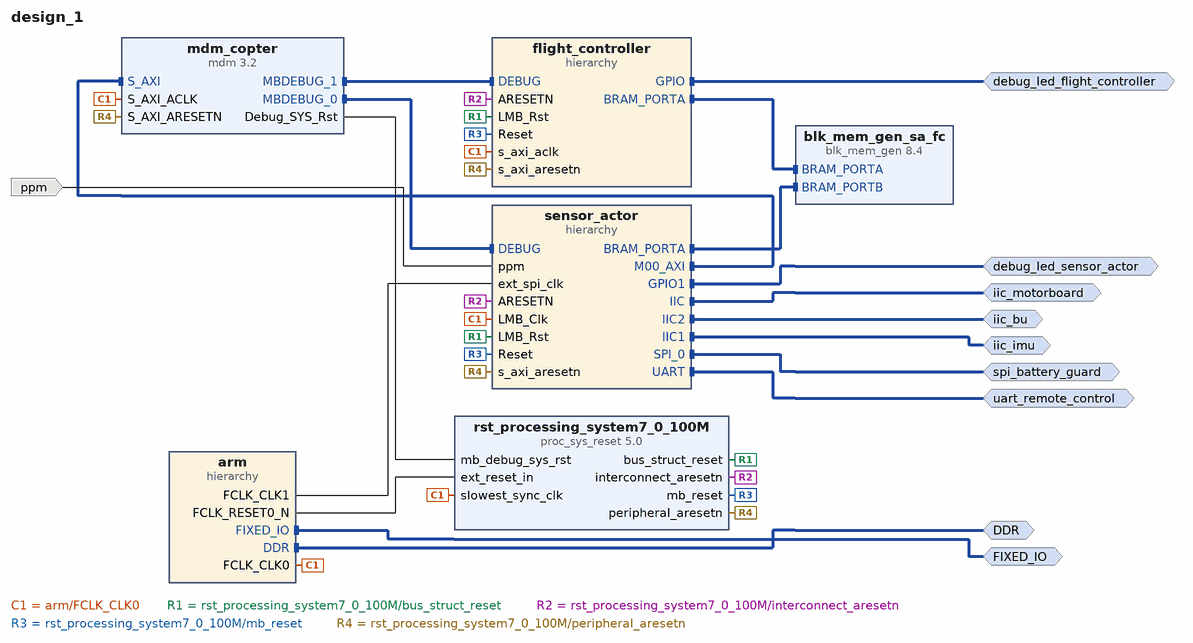
[diagram p0: block diagram of the top level]
# Vivado block design design_1, xc7z020clg484-1, Vivado 2018.3
create_bd_design design_1

create_bd_intf_port -mode Master -vlnv xilinx.com:interface:ddrx_rtl:1.0 DDR
create_bd_intf_port -mode Master -vlnv xilinx.com:display_processing_system7:fixedio_rtl:1.0 FIXED_IO
create_bd_intf_port -mode Master -vlnv xilinx.com:interface:gpio_rtl:1.0 debug_led_flight_controller
create_bd_intf_port -mode Master -vlnv xilinx.com:interface:gpio_rtl:1.0 debug_led_sensor_actor
create_bd_intf_port -mode Master -vlnv xilinx.com:interface:iic_rtl:1.0 iic_bu
create_bd_intf_port -mode Master -vlnv xilinx.com:interface:iic_rtl:1.0 iic_motorboard
create_bd_intf_port -mode Master -vlnv xilinx.com:interface:iic_rtl:1.0 iic_imu
create_bd_intf_port -mode Master -vlnv xilinx.com:interface:spi_rtl:1.0 spi_battery_guard
create_bd_intf_port -mode Master -vlnv xilinx.com:interface:uart_rtl:1.0 uart_remote_control
create_bd_port -dir I ppm

create_bd_cell -type hier flight_controller
create_bd_cell -type hier sensor_actor
create_bd_cell -type hier arm
create_bd_cell -type ip -vlnv xilinx.com:ip:blk_mem_gen:8.4 blk_mem_gen_sa_fc
set_property -dict [list \
  CONFIG.EN_SAFETY_CKT false \
  CONFIG.Enable_B Use_ENB_Pin \
  CONFIG.Memory_Type True_Dual_Port_RAM \
  CONFIG.Port_B_Clock 100 \
  CONFIG.Port_B_Enable_Rate 100 \
  CONFIG.Port_B_Write_Rate 50 \
  CONFIG.Use_RSTB_Pin true \
] [get_bd_cells blk_mem_gen_sa_fc]
create_bd_cell -type ip -vlnv xilinx.com:ip:mdm:3.2 mdm_copter
set_property -dict {CONFIG.C_MB_DBG_PORTS 2 CONFIG.C_USE_UART 1} [get_bd_cells mdm_copter]
create_bd_cell -type ip -vlnv xilinx.com:ip:proc_sys_reset:5.0 rst_processing_system7_0_100M

# ---- hierarchy /flight_controller ----
current_bd_instance /flight_controller
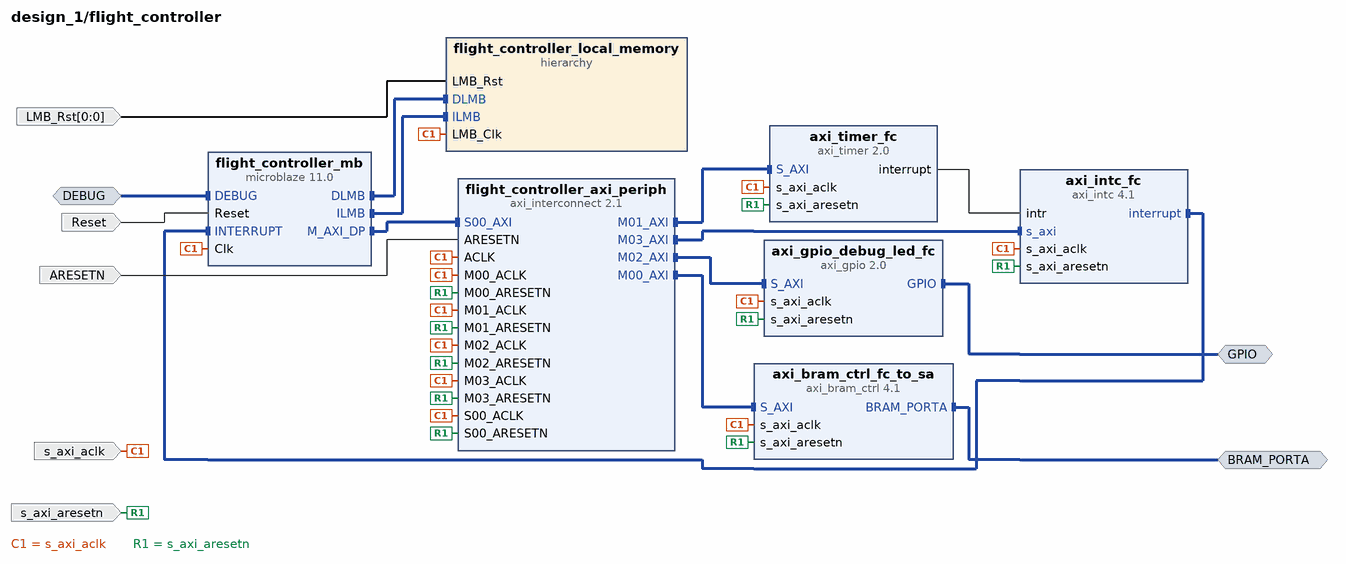
[diagram p1: block diagram inside /flight_controller]
create_bd_intf_pin -mode Master -vlnv xilinx.com:interface:gpio_rtl:1.0 GPIO
create_bd_intf_pin -mode Slave -vlnv xilinx.com:interface:mbdebug_rtl:3.0 DEBUG
create_bd_intf_pin -mode Master -vlnv xilinx.com:interface:bram_rtl:1.0 BRAM_PORTA
create_bd_pin -dir I -type clk s_axi_aclk
create_bd_pin -dir I -type rst s_axi_aresetn
create_bd_pin -dir I -type rst Reset
create_bd_pin -dir I -type rst ARESETN
create_bd_pin -dir I -from 0 -to 0 -type rst LMB_Rst

create_bd_cell -type hier flight_controller_local_memory
create_bd_cell -type ip -vlnv xilinx.com:ip:axi_bram_ctrl:4.1 axi_bram_ctrl_fc_to_sa
set_property -dict {CONFIG.C_SELECT_XPM 0 CONFIG.SINGLE_PORT_BRAM 1} [get_bd_cells axi_bram_ctrl_fc_to_sa]
create_bd_cell -type ip -vlnv xilinx.com:ip:axi_gpio:2.0 axi_gpio_debug_led_fc
set_property -dict {CONFIG.C_ALL_OUTPUTS 1 CONFIG.C_GPIO_WIDTH 2} [get_bd_cells axi_gpio_debug_led_fc]
create_bd_cell -type ip -vlnv xilinx.com:ip:axi_intc:4.1 axi_intc_fc
create_bd_cell -type ip -vlnv xilinx.com:ip:axi_timer:2.0 axi_timer_fc
create_bd_cell -type ip -vlnv xilinx.com:ip:microblaze:11.0 flight_controller_mb
set_property -dict [list \
  CONFIG.C_D_AXI 1 \
  CONFIG.C_USE_DIV 1 \
  CONFIG.C_USE_FPU 2 \
  CONFIG.C_USE_HW_MUL 2 \
] [get_bd_cells flight_controller_mb]
create_bd_cell -type ip -vlnv xilinx.com:ip:axi_interconnect:2.1 flight_controller_axi_periph
set_property -dict {CONFIG.NUM_MI 4 CONFIG.SYNCHRONIZATION_STAGES 2} [get_bd_cells flight_controller_axi_periph]

# ---- hierarchy /flight_controller/flight_controller_local_memory ----
current_bd_instance /flight_controller/flight_controller_local_memory
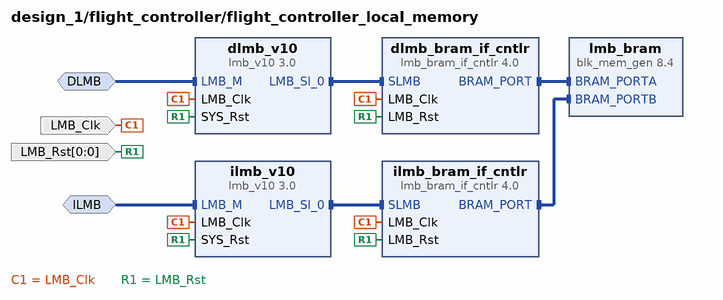
[diagram p2: block diagram inside /flight_controller/flight_controller_local_memory]
create_bd_intf_pin -mode MirroredMaster -vlnv xilinx.com:interface:lmb_rtl:1.0 DLMB
create_bd_intf_pin -mode MirroredMaster -vlnv xilinx.com:interface:lmb_rtl:1.0 ILMB
create_bd_pin -dir I -type clk LMB_Clk
create_bd_pin -dir I -from 0 -to 0 -type rst LMB_Rst

create_bd_cell -type ip -vlnv xilinx.com:ip:lmb_v10:3.0 dlmb_v10
create_bd_cell -type ip -vlnv xilinx.com:ip:lmb_v10:3.0 ilmb_v10
create_bd_cell -type ip -vlnv xilinx.com:ip:lmb_bram_if_cntlr:4.0 dlmb_bram_if_cntlr
create_bd_cell -type ip -vlnv xilinx.com:ip:lmb_bram_if_cntlr:4.0 ilmb_bram_if_cntlr
create_bd_cell -type ip -vlnv xilinx.com:ip:blk_mem_gen:8.4 lmb_bram
set_property -dict [list \
  CONFIG.EN_SAFETY_CKT false \
  CONFIG.Enable_B Use_ENB_Pin \
  CONFIG.Memory_Type True_Dual_Port_RAM \
  CONFIG.Port_B_Clock 100 \
  CONFIG.Port_B_Enable_Rate 100 \
  CONFIG.Port_B_Write_Rate 50 \
  CONFIG.Use_RSTB_Pin true \
] [get_bd_cells lmb_bram]

# ---- hierarchy /sensor_actor ----
current_bd_instance /sensor_actor
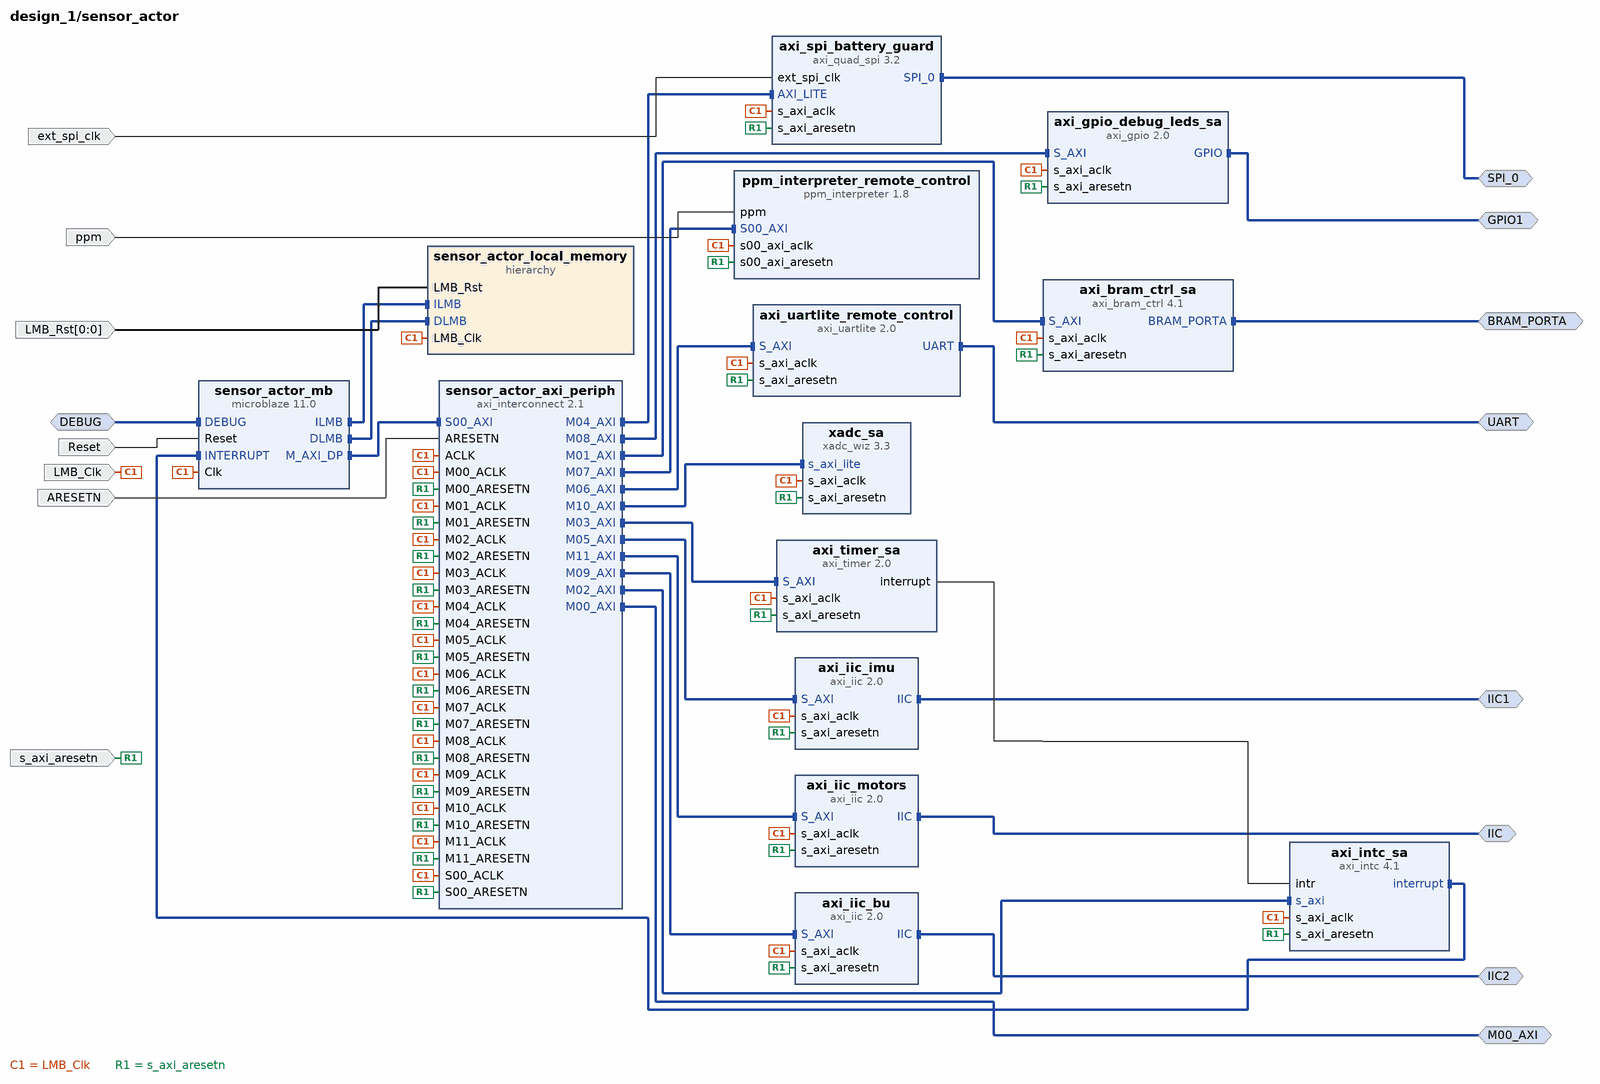
[diagram p3: block diagram inside /sensor_actor]
create_bd_intf_pin -mode Master -vlnv xilinx.com:interface:iic_rtl:1.0 IIC
create_bd_intf_pin -mode Master -vlnv xilinx.com:interface:iic_rtl:1.0 IIC1
create_bd_intf_pin -mode Master -vlnv xilinx.com:interface:spi_rtl:1.0 SPI_0
create_bd_intf_pin -mode Master -vlnv xilinx.com:interface:uart_rtl:1.0 UART
create_bd_intf_pin -mode Master -vlnv xilinx.com:interface:gpio_rtl:1.0 GPIO1
create_bd_intf_pin -mode Slave -vlnv xilinx.com:interface:mbdebug_rtl:3.0 DEBUG
create_bd_intf_pin -mode Master -vlnv xilinx.com:interface:iic_rtl:1.0 IIC2
create_bd_intf_pin -mode Master -vlnv xilinx.com:interface:aximm_rtl:1.0 M00_AXI
create_bd_intf_pin -mode Master -vlnv xilinx.com:interface:bram_rtl:1.0 BRAM_PORTA
create_bd_pin -dir I ppm
create_bd_pin -dir I -type clk LMB_Clk
create_bd_pin -dir I -type rst s_axi_aresetn
create_bd_pin -dir I -type clk ext_spi_clk
create_bd_pin -dir I -type rst Reset
create_bd_pin -dir I -from 0 -to 0 -type rst LMB_Rst
create_bd_pin -dir I -type rst ARESETN

create_bd_cell -type hier sensor_actor_local_memory
create_bd_cell -type ip -vlnv ppm:user:ppm_interpreter:1.8 ppm_interpreter_remote_control
create_bd_cell -type ip -vlnv xilinx.com:ip:axi_bram_ctrl:4.1 axi_bram_ctrl_sa
set_property -dict {CONFIG.C_SELECT_XPM 0 CONFIG.SINGLE_PORT_BRAM 1} [get_bd_cells axi_bram_ctrl_sa]
create_bd_cell -type ip -vlnv xilinx.com:ip:axi_gpio:2.0 axi_gpio_debug_leds_sa
set_property -dict {CONFIG.C_ALL_OUTPUTS 1 CONFIG.C_GPIO_WIDTH 2} [get_bd_cells axi_gpio_debug_leds_sa]
create_bd_cell -type ip -vlnv xilinx.com:ip:axi_iic:2.0 axi_iic_bu
set_property -dict {CONFIG.IIC_FREQ_KHZ 100} [get_bd_cells axi_iic_bu]
create_bd_cell -type ip -vlnv xilinx.com:ip:axi_iic:2.0 axi_iic_motors
set_property -dict {CONFIG.IIC_FREQ_KHZ 100} [get_bd_cells axi_iic_motors]
create_bd_cell -type ip -vlnv xilinx.com:ip:axi_iic:2.0 axi_iic_imu
set_property -dict {CONFIG.IIC_FREQ_KHZ 100} [get_bd_cells axi_iic_imu]
create_bd_cell -type ip -vlnv xilinx.com:ip:axi_intc:4.1 axi_intc_sa
create_bd_cell -type ip -vlnv xilinx.com:ip:axi_quad_spi:3.2 axi_spi_battery_guard
set_property -dict [list \
  CONFIG.C_FIFO_DEPTH 0 \
  CONFIG.C_NUM_SS_BITS 2 \
  CONFIG.C_S_AXI4_ID_WIDTH 0 \
  CONFIG.C_USE_STARTUP 0 \
  CONFIG.FIFO_INCLUDED 0 \
  CONFIG.Multiples16 2 \
] [get_bd_cells axi_spi_battery_guard]
create_bd_cell -type ip -vlnv xilinx.com:ip:axi_timer:2.0 axi_timer_sa
create_bd_cell -type ip -vlnv xilinx.com:ip:axi_uartlite:2.0 axi_uartlite_remote_control
set_property -dict {CONFIG.C_BAUDRATE 19200} [get_bd_cells axi_uartlite_remote_control]
create_bd_cell -type ip -vlnv xilinx.com:ip:microblaze:11.0 sensor_actor_mb
set_property -dict {CONFIG.C_D_AXI 1 CONFIG.C_USE_DIV 1 CONFIG.C_USE_FPU 2 CONFIG.C_USE_HW_MUL 2} [get_bd_cells sensor_actor_mb]
create_bd_cell -type ip -vlnv xilinx.com:ip:axi_interconnect:2.1 sensor_actor_axi_periph
set_property -dict {CONFIG.NUM_MI 12 CONFIG.SYNCHRONIZATION_STAGES 2} [get_bd_cells sensor_actor_axi_periph]
create_bd_cell -type ip -vlnv xilinx.com:ip:xadc_wiz:3.3 xadc_sa
set_property -dict [list \
  CONFIG.ENABLE_RESET false \
  CONFIG.ENABLE_VCCDDRO_ALARM false \
  CONFIG.ENABLE_VCCPAUX_ALARM false \
  CONFIG.ENABLE_VCCPINT_ALARM false \
  CONFIG.INTERFACE_SELECTION Enable_AXI \
  CONFIG.OT_ALARM false \
  CONFIG.USER_TEMP_ALARM false \
  CONFIG.VCCAUX_ALARM false \
  CONFIG.VCCINT_ALARM false \
] [get_bd_cells xadc_sa]

# ---- hierarchy /sensor_actor/sensor_actor_local_memory ----
current_bd_instance /sensor_actor/sensor_actor_local_memory
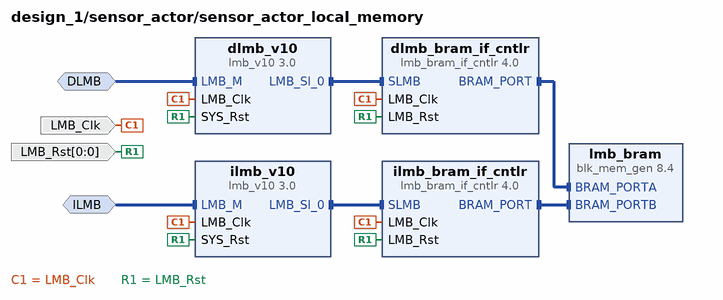
[diagram p4: block diagram inside /sensor_actor/sensor_actor_local_memory]
create_bd_intf_pin -mode MirroredMaster -vlnv xilinx.com:interface:lmb_rtl:1.0 DLMB
create_bd_intf_pin -mode MirroredMaster -vlnv xilinx.com:interface:lmb_rtl:1.0 ILMB
create_bd_pin -dir I -type clk LMB_Clk
create_bd_pin -dir I -from 0 -to 0 -type rst LMB_Rst

create_bd_cell -type ip -vlnv xilinx.com:ip:lmb_v10:3.0 dlmb_v10
create_bd_cell -type ip -vlnv xilinx.com:ip:lmb_v10:3.0 ilmb_v10
create_bd_cell -type ip -vlnv xilinx.com:ip:lmb_bram_if_cntlr:4.0 dlmb_bram_if_cntlr
create_bd_cell -type ip -vlnv xilinx.com:ip:lmb_bram_if_cntlr:4.0 ilmb_bram_if_cntlr
create_bd_cell -type ip -vlnv xilinx.com:ip:blk_mem_gen:8.4 lmb_bram
set_property -dict [list \
  CONFIG.EN_SAFETY_CKT false \
  CONFIG.Enable_B Use_ENB_Pin \
  CONFIG.Memory_Type True_Dual_Port_RAM \
  CONFIG.Port_B_Clock 100 \
  CONFIG.Port_B_Enable_Rate 100 \
  CONFIG.Port_B_Write_Rate 50 \
  CONFIG.Use_RSTB_Pin true \
] [get_bd_cells lmb_bram]

# ---- hierarchy /arm ----
current_bd_instance /arm
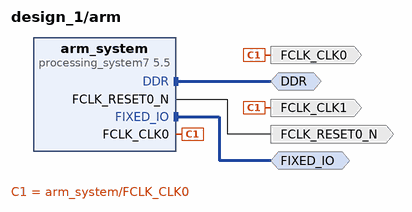
[diagram p5: block diagram inside /arm]
create_bd_intf_pin -mode Master -vlnv xilinx.com:interface:ddrx_rtl:1.0 DDR
create_bd_intf_pin -mode Master -vlnv xilinx.com:display_processing_system7:fixedio_rtl:1.0 FIXED_IO
create_bd_pin -dir O -type clk FCLK_CLK0
create_bd_pin -dir O -type clk FCLK_CLK1
create_bd_pin -dir O -type rst FCLK_RESET0_N

create_bd_cell -type ip -vlnv xilinx.com:ip:processing_system7:5.5 arm_system
set_property -dict [list \
  CONFIG.PCW_APU_PERIPHERAL_FREQMHZ 666.666667 \
  CONFIG.PCW_ENET0_ENET0_IO {MIO 16 .. 27} \
  CONFIG.PCW_ENET0_GRP_MDIO_ENABLE 1 \
  CONFIG.PCW_ENET0_GRP_MDIO_IO {MIO 52 .. 53} \
  CONFIG.PCW_ENET0_PERIPHERAL_ENABLE 1 \
  CONFIG.PCW_ENET0_RESET_ENABLE 0 \
  CONFIG.PCW_ENET_RESET_ENABLE 1 \
  CONFIG.PCW_ENET_RESET_SELECT {Share reset pin} \
  CONFIG.PCW_FPGA0_PERIPHERAL_FREQMHZ 100.000000 \
  CONFIG.PCW_FPGA1_PERIPHERAL_FREQMHZ 150.000000 \
  CONFIG.PCW_FPGA2_PERIPHERAL_FREQMHZ 50.000000 \
  CONFIG.PCW_GP0_EN_MODIFIABLE_TXN 0 \
  CONFIG.PCW_GP1_EN_MODIFIABLE_TXN 0 \
  CONFIG.PCW_GPIO_MIO_GPIO_ENABLE 1 \
  CONFIG.PCW_GPIO_MIO_GPIO_IO MIO \
  CONFIG.PCW_I2C_RESET_ENABLE 1 \
  CONFIG.PCW_PERIPHERAL_BOARD_PRESET part0 \
  CONFIG.PCW_PRESET_BANK1_VOLTAGE {LVCMOS 1.8V} \
  CONFIG.PCW_QSPI_GRP_SINGLE_SS_ENABLE 1 \
  CONFIG.PCW_QSPI_GRP_SINGLE_SS_IO {MIO 1 .. 6} \
  CONFIG.PCW_QSPI_PERIPHERAL_ENABLE 1 \
  CONFIG.PCW_QSPI_PERIPHERAL_FREQMHZ 200.000000 \
  CONFIG.PCW_QSPI_QSPI_IO {MIO 1 .. 6} \
  CONFIG.PCW_SD0_GRP_CD_ENABLE 1 \
  CONFIG.PCW_SD0_GRP_CD_IO {MIO 47} \
  CONFIG.PCW_SD0_GRP_WP_ENABLE 1 \
  CONFIG.PCW_SD0_GRP_WP_IO {MIO 46} \
  CONFIG.PCW_SD0_PERIPHERAL_ENABLE 1 \
  CONFIG.PCW_SD0_SD0_IO {MIO 40 .. 45} \
  CONFIG.PCW_SDIO_PERIPHERAL_FREQMHZ 50 \
  CONFIG.PCW_SINGLE_QSPI_DATA_MODE x4 \
  CONFIG.PCW_TTC0_PERIPHERAL_ENABLE 1 \
  CONFIG.PCW_TTC0_TTC0_IO EMIO \
  CONFIG.PCW_UART1_PERIPHERAL_ENABLE 1 \
  CONFIG.PCW_UART1_UART1_IO {MIO 48 .. 49} \
  CONFIG.PCW_UART_PERIPHERAL_FREQMHZ 50 \
  CONFIG.PCW_UIPARAM_DDR_FREQ_MHZ 533.333313 \
  CONFIG.PCW_UIPARAM_DDR_PARTNO {MT41J128M16 HA-15E} \
  CONFIG.PCW_USB0_PERIPHERAL_ENABLE 1 \
  CONFIG.PCW_USB0_RESET_ENABLE 0 \
  CONFIG.PCW_USB0_USB0_IO {MIO 28 .. 39} \
  CONFIG.PCW_USB_RESET_ENABLE 1 \
  CONFIG.PCW_USB_RESET_SELECT {Share reset pin} \
  CONFIG.PCW_USE_M_AXI_GP0 0 \
  CONFIG.preset ZedBoard \
] [get_bd_cells arm_system]
# 494 more settings of arm_system are not shown: defaults, MIO pin electricals, DDR timing, and values the tool derives

# ---- connections ----

current_bd_instance /flight_controller
connect_bd_intf_net [get_bd_intf_pins BRAM_PORTA] [get_bd_intf_pins axi_bram_ctrl_fc_to_sa/BRAM_PORTA]
connect_bd_intf_net [get_bd_intf_pins DEBUG] [get_bd_intf_pins flight_controller_mb/DEBUG]
connect_bd_intf_net [get_bd_intf_pins GPIO] [get_bd_intf_pins axi_gpio_debug_led_fc/GPIO]
connect_bd_intf_net [get_bd_intf_pins flight_controller_axi_periph/M03_AXI] [get_bd_intf_pins axi_intc_fc/s_axi]
connect_bd_intf_net [get_bd_intf_pins flight_controller_axi_periph/M00_AXI] [get_bd_intf_pins axi_bram_ctrl_fc_to_sa/S_AXI]
connect_bd_intf_net [get_bd_intf_pins flight_controller_mb/DLMB] [get_bd_intf_pins flight_controller_local_memory/DLMB]
connect_bd_intf_net [get_bd_intf_pins flight_controller_mb/ILMB] [get_bd_intf_pins flight_controller_local_memory/ILMB]
connect_bd_intf_net [get_bd_intf_pins axi_timer_fc/S_AXI] [get_bd_intf_pins flight_controller_axi_periph/M01_AXI]
connect_bd_intf_net [get_bd_intf_pins axi_gpio_debug_led_fc/S_AXI] [get_bd_intf_pins flight_controller_axi_periph/M02_AXI]
connect_bd_intf_net [get_bd_intf_pins axi_intc_fc/interrupt] [get_bd_intf_pins flight_controller_mb/INTERRUPT]
connect_bd_intf_net [get_bd_intf_pins flight_controller_mb/M_AXI_DP] [get_bd_intf_pins flight_controller_axi_periph/S00_AXI]
connect_bd_net -net axi_timer_asg_interrupt [get_bd_pins axi_timer_fc/interrupt] [get_bd_pins axi_intc_fc/intr]
connect_bd_net -net mb_dataminer_Clk [get_bd_pins s_axi_aclk] \
  [get_bd_pins flight_controller_local_memory/LMB_Clk] [get_bd_pins axi_bram_ctrl_fc_to_sa/s_axi_aclk] \
  [get_bd_pins axi_gpio_debug_led_fc/s_axi_aclk] [get_bd_pins axi_intc_fc/s_axi_aclk] [get_bd_pins axi_timer_fc/s_axi_aclk] \
  [get_bd_pins flight_controller_mb/Clk] [get_bd_pins flight_controller_axi_periph/ACLK] \
  [get_bd_pins flight_controller_axi_periph/S00_ACLK] [get_bd_pins flight_controller_axi_periph/M00_ACLK] \
  [get_bd_pins flight_controller_axi_periph/M01_ACLK] [get_bd_pins flight_controller_axi_periph/M02_ACLK] \
  [get_bd_pins flight_controller_axi_periph/M03_ACLK]
connect_bd_net -net rst_processing_system7_0_100M_peripheral_aresetn [get_bd_pins s_axi_aresetn] \
  [get_bd_pins axi_bram_ctrl_fc_to_sa/s_axi_aresetn] [get_bd_pins axi_gpio_debug_led_fc/s_axi_aresetn] \
  [get_bd_pins axi_intc_fc/s_axi_aresetn] [get_bd_pins axi_timer_fc/s_axi_aresetn] \
  [get_bd_pins flight_controller_axi_periph/S00_ARESETN] [get_bd_pins flight_controller_axi_periph/M00_ARESETN] \
  [get_bd_pins flight_controller_axi_periph/M01_ARESETN] [get_bd_pins flight_controller_axi_periph/M02_ARESETN] \
  [get_bd_pins flight_controller_axi_periph/M03_ARESETN]
connect_bd_net -net rst_processing_system7_0_100M_mb_reset [get_bd_pins Reset] [get_bd_pins flight_controller_mb/Reset]
connect_bd_net -net rst_processing_system7_0_100M_interconnect_aresetn [get_bd_pins ARESETN] [get_bd_pins flight_controller_axi_periph/ARESETN]
connect_bd_net [get_bd_pins LMB_Rst] [get_bd_pins flight_controller_local_memory/LMB_Rst]
set_property HDL_ATTRIBUTE.BMM_INFO_ADDRESS_SPACE {byte  0x40000000 32 > design_1 blk_mem_gen_sa_fc} [get_bd_cells axi_bram_ctrl_fc_to_sa]
set_property HDL_ATTRIBUTE.KEEP_HIERARCHY yes [get_bd_cells axi_bram_ctrl_fc_to_sa]
set_property HDL_ATTRIBUTE.BMM_INFO_PROCESSOR {microblaze-le > design_1 flight_controller/flight_controller_local_memory/dlmb_bram_if_cntlr design_1 flight_controller/axi_bram_ctrl_fc_to_sa} [get_bd_cells flight_controller_mb]
set_property HDL_ATTRIBUTE.KEEP_HIERARCHY yes [get_bd_cells flight_controller_mb]

current_bd_instance /flight_controller/flight_controller_local_memory
connect_bd_intf_net [get_bd_intf_pins dlmb_bram_if_cntlr/SLMB] [get_bd_intf_pins dlmb_v10/LMB_Sl_0]
connect_bd_intf_net [get_bd_intf_pins dlmb_bram_if_cntlr/BRAM_PORT] [get_bd_intf_pins lmb_bram/BRAM_PORTA]
connect_bd_intf_net [get_bd_intf_pins ilmb_bram_if_cntlr/SLMB] [get_bd_intf_pins ilmb_v10/LMB_Sl_0]
connect_bd_intf_net [get_bd_intf_pins DLMB] [get_bd_intf_pins dlmb_v10/LMB_M]
connect_bd_intf_net [get_bd_intf_pins ilmb_bram_if_cntlr/BRAM_PORT] [get_bd_intf_pins lmb_bram/BRAM_PORTB]
connect_bd_intf_net [get_bd_intf_pins ILMB] [get_bd_intf_pins ilmb_v10/LMB_M]
connect_bd_net -net microblaze_0_Clk [get_bd_pins LMB_Clk] \
  [get_bd_pins dlmb_v10/LMB_Clk] [get_bd_pins ilmb_v10/LMB_Clk] [get_bd_pins dlmb_bram_if_cntlr/LMB_Clk] \
  [get_bd_pins ilmb_bram_if_cntlr/LMB_Clk]
connect_bd_net -net microblaze_0_LMB_Rst [get_bd_pins LMB_Rst] \
  [get_bd_pins dlmb_v10/SYS_Rst] [get_bd_pins ilmb_v10/SYS_Rst] [get_bd_pins dlmb_bram_if_cntlr/LMB_Rst] \
  [get_bd_pins ilmb_bram_if_cntlr/LMB_Rst]
set_property HDL_ATTRIBUTE.BMM_INFO_ADDRESS_SPACE {byte  0x00000000 32 > design_1 flight_controller/flight_controller_local_memory/lmb_bram} [get_bd_cells dlmb_bram_if_cntlr]
set_property HDL_ATTRIBUTE.KEEP_HIERARCHY yes [get_bd_cells dlmb_bram_if_cntlr]

current_bd_instance /sensor_actor
connect_bd_intf_net [get_bd_intf_pins IIC1] [get_bd_intf_pins axi_iic_imu/IIC]
connect_bd_intf_net [get_bd_intf_pins sensor_actor_mb/M_AXI_DP] [get_bd_intf_pins sensor_actor_axi_periph/S00_AXI]
connect_bd_intf_net [get_bd_intf_pins sensor_actor_axi_periph/M07_AXI] [get_bd_intf_pins ppm_interpreter_remote_control/S00_AXI]
connect_bd_intf_net [get_bd_intf_pins sensor_actor_axi_periph/M10_AXI] [get_bd_intf_pins xadc_sa/s_axi_lite]
connect_bd_intf_net [get_bd_intf_pins sensor_actor_mb/ILMB] [get_bd_intf_pins sensor_actor_local_memory/ILMB]
connect_bd_intf_net [get_bd_intf_pins sensor_actor_axi_periph/M01_AXI] [get_bd_intf_pins axi_bram_ctrl_sa/S_AXI]
connect_bd_intf_net [get_bd_intf_pins axi_timer_sa/S_AXI] [get_bd_intf_pins sensor_actor_axi_periph/M03_AXI]
connect_bd_intf_net [get_bd_intf_pins SPI_0] [get_bd_intf_pins axi_spi_battery_guard/SPI_0]
connect_bd_intf_net [get_bd_intf_pins axi_spi_battery_guard/AXI_LITE] [get_bd_intf_pins sensor_actor_axi_periph/M04_AXI]
connect_bd_intf_net [get_bd_intf_pins axi_intc_sa/interrupt] [get_bd_intf_pins sensor_actor_mb/INTERRUPT]
connect_bd_intf_net [get_bd_intf_pins DEBUG] [get_bd_intf_pins sensor_actor_mb/DEBUG]
connect_bd_intf_net [get_bd_intf_pins BRAM_PORTA] [get_bd_intf_pins axi_bram_ctrl_sa/BRAM_PORTA]
connect_bd_intf_net [get_bd_intf_pins sensor_actor_axi_periph/M11_AXI] [get_bd_intf_pins axi_iic_motors/S_AXI]
connect_bd_intf_net [get_bd_intf_pins axi_iic_imu/S_AXI] [get_bd_intf_pins sensor_actor_axi_periph/M05_AXI]
connect_bd_intf_net [get_bd_intf_pins IIC] [get_bd_intf_pins axi_iic_motors/IIC]
connect_bd_intf_net [get_bd_intf_pins sensor_actor_mb/DLMB] [get_bd_intf_pins sensor_actor_local_memory/DLMB]
connect_bd_intf_net [get_bd_intf_pins axi_uartlite_remote_control/S_AXI] [get_bd_intf_pins sensor_actor_axi_periph/M06_AXI]
connect_bd_intf_net [get_bd_intf_pins GPIO1] [get_bd_intf_pins axi_gpio_debug_leds_sa/GPIO]
connect_bd_intf_net [get_bd_intf_pins axi_iic_bu/S_AXI] [get_bd_intf_pins sensor_actor_axi_periph/M09_AXI]
connect_bd_intf_net [get_bd_intf_pins IIC2] [get_bd_intf_pins axi_iic_bu/IIC]
connect_bd_intf_net [get_bd_intf_pins M00_AXI] [get_bd_intf_pins sensor_actor_axi_periph/M00_AXI]
connect_bd_intf_net [get_bd_intf_pins UART] [get_bd_intf_pins axi_uartlite_remote_control/UART]
connect_bd_intf_net [get_bd_intf_pins axi_gpio_debug_leds_sa/S_AXI] [get_bd_intf_pins sensor_actor_axi_periph/M08_AXI]
connect_bd_intf_net [get_bd_intf_pins axi_intc_sa/s_axi] [get_bd_intf_pins sensor_actor_axi_periph/M02_AXI]
connect_bd_net -net axi_timer_dataminer_interrupt [get_bd_pins axi_timer_sa/interrupt] [get_bd_pins axi_intc_sa/intr]
connect_bd_net [get_bd_pins ppm] [get_bd_pins ppm_interpreter_remote_control/ppm]
connect_bd_net -net mb_dataminer_Clk [get_bd_pins LMB_Clk] \
  [get_bd_pins ppm_interpreter_remote_control/s00_axi_aclk] [get_bd_pins sensor_actor_local_memory/LMB_Clk] \
  [get_bd_pins axi_bram_ctrl_sa/s_axi_aclk] [get_bd_pins axi_gpio_debug_leds_sa/s_axi_aclk] \
  [get_bd_pins axi_iic_bu/s_axi_aclk] [get_bd_pins axi_iic_motors/s_axi_aclk] [get_bd_pins axi_iic_imu/s_axi_aclk] \
  [get_bd_pins axi_intc_sa/s_axi_aclk] [get_bd_pins axi_spi_battery_guard/s_axi_aclk] [get_bd_pins axi_timer_sa/s_axi_aclk] \
  [get_bd_pins axi_uartlite_remote_control/s_axi_aclk] [get_bd_pins sensor_actor_mb/Clk] \
  [get_bd_pins sensor_actor_axi_periph/ACLK] [get_bd_pins sensor_actor_axi_periph/S00_ACLK] \
  [get_bd_pins sensor_actor_axi_periph/M00_ACLK] [get_bd_pins sensor_actor_axi_periph/M01_ACLK] \
  [get_bd_pins sensor_actor_axi_periph/M02_ACLK] [get_bd_pins sensor_actor_axi_periph/M03_ACLK] \
  [get_bd_pins sensor_actor_axi_periph/M04_ACLK] [get_bd_pins sensor_actor_axi_periph/M05_ACLK] \
  [get_bd_pins sensor_actor_axi_periph/M06_ACLK] [get_bd_pins sensor_actor_axi_periph/M07_ACLK] \
  [get_bd_pins sensor_actor_axi_periph/M08_ACLK] [get_bd_pins sensor_actor_axi_periph/M09_ACLK] \
  [get_bd_pins sensor_actor_axi_periph/M10_ACLK] [get_bd_pins sensor_actor_axi_periph/M11_ACLK] \
  [get_bd_pins xadc_sa/s_axi_aclk]
connect_bd_net -net rst_processing_system7_0_100M_peripheral_aresetn [get_bd_pins s_axi_aresetn] \
  [get_bd_pins ppm_interpreter_remote_control/s00_axi_aresetn] [get_bd_pins axi_bram_ctrl_sa/s_axi_aresetn] \
  [get_bd_pins axi_gpio_debug_leds_sa/s_axi_aresetn] [get_bd_pins axi_iic_bu/s_axi_aresetn] \
  [get_bd_pins axi_iic_motors/s_axi_aresetn] [get_bd_pins axi_iic_imu/s_axi_aresetn] [get_bd_pins axi_intc_sa/s_axi_aresetn] \
  [get_bd_pins axi_spi_battery_guard/s_axi_aresetn] [get_bd_pins axi_timer_sa/s_axi_aresetn] \
  [get_bd_pins axi_uartlite_remote_control/s_axi_aresetn] [get_bd_pins sensor_actor_axi_periph/S00_ARESETN] \
  [get_bd_pins sensor_actor_axi_periph/M00_ARESETN] [get_bd_pins sensor_actor_axi_periph/M01_ARESETN] \
  [get_bd_pins sensor_actor_axi_periph/M02_ARESETN] [get_bd_pins sensor_actor_axi_periph/M03_ARESETN] \
  [get_bd_pins sensor_actor_axi_periph/M04_ARESETN] [get_bd_pins sensor_actor_axi_periph/M05_ARESETN] \
  [get_bd_pins sensor_actor_axi_periph/M06_ARESETN] [get_bd_pins sensor_actor_axi_periph/M07_ARESETN] \
  [get_bd_pins sensor_actor_axi_periph/M08_ARESETN] [get_bd_pins sensor_actor_axi_periph/M09_ARESETN] \
  [get_bd_pins sensor_actor_axi_periph/M10_ARESETN] [get_bd_pins sensor_actor_axi_periph/M11_ARESETN] \
  [get_bd_pins xadc_sa/s_axi_aresetn]
connect_bd_net -net aevv_system_FCLK_CLK1 [get_bd_pins ext_spi_clk] [get_bd_pins axi_spi_battery_guard/ext_spi_clk]
connect_bd_net -net rst_processing_system7_0_100M_mb_reset [get_bd_pins Reset] [get_bd_pins sensor_actor_mb/Reset]
connect_bd_net -net rst_processing_system7_0_100M_bus_struct_reset [get_bd_pins LMB_Rst] [get_bd_pins sensor_actor_local_memory/LMB_Rst]
connect_bd_net -net rst_processing_system7_0_100M_interconnect_aresetn [get_bd_pins ARESETN] [get_bd_pins sensor_actor_axi_periph/ARESETN]
set_property HDL_ATTRIBUTE.BMM_INFO_ADDRESS_SPACE {byte  0xC0000000 32 > design_1 blk_mem_gen_sa_fc} [get_bd_cells axi_bram_ctrl_sa]
set_property HDL_ATTRIBUTE.KEEP_HIERARCHY yes [get_bd_cells axi_bram_ctrl_sa]
set_property HDL_ATTRIBUTE.BMM_INFO_PROCESSOR {microblaze-le > design_1 sensor_actor/sensor_actor_local_memory/dlmb_bram_if_cntlr design_1 sensor_actor/axi_bram_ctrl_sa} [get_bd_cells sensor_actor_mb]
set_property HDL_ATTRIBUTE.KEEP_HIERARCHY yes [get_bd_cells sensor_actor_mb]

current_bd_instance /sensor_actor/sensor_actor_local_memory
connect_bd_intf_net [get_bd_intf_pins ilmb_bram_if_cntlr/SLMB] [get_bd_intf_pins ilmb_v10/LMB_Sl_0]
connect_bd_intf_net [get_bd_intf_pins ILMB] [get_bd_intf_pins ilmb_v10/LMB_M]
connect_bd_intf_net [get_bd_intf_pins DLMB] [get_bd_intf_pins dlmb_v10/LMB_M]
connect_bd_intf_net [get_bd_intf_pins ilmb_bram_if_cntlr/BRAM_PORT] [get_bd_intf_pins lmb_bram/BRAM_PORTB]
connect_bd_intf_net [get_bd_intf_pins dlmb_bram_if_cntlr/BRAM_PORT] [get_bd_intf_pins lmb_bram/BRAM_PORTA]
connect_bd_intf_net [get_bd_intf_pins dlmb_bram_if_cntlr/SLMB] [get_bd_intf_pins dlmb_v10/LMB_Sl_0]
connect_bd_net -net mb_dataminer_Clk [get_bd_pins LMB_Clk] \
  [get_bd_pins dlmb_v10/LMB_Clk] [get_bd_pins ilmb_v10/LMB_Clk] [get_bd_pins dlmb_bram_if_cntlr/LMB_Clk] \
  [get_bd_pins ilmb_bram_if_cntlr/LMB_Clk]
connect_bd_net -net mb_dataminer_LMB_Rst [get_bd_pins LMB_Rst] \
  [get_bd_pins dlmb_v10/SYS_Rst] [get_bd_pins ilmb_v10/SYS_Rst] [get_bd_pins dlmb_bram_if_cntlr/LMB_Rst] \
  [get_bd_pins ilmb_bram_if_cntlr/LMB_Rst]
set_property HDL_ATTRIBUTE.BMM_INFO_ADDRESS_SPACE {byte  0x00000000 32 > design_1 sensor_actor/sensor_actor_local_memory/lmb_bram} [get_bd_cells dlmb_bram_if_cntlr]
set_property HDL_ATTRIBUTE.KEEP_HIERARCHY yes [get_bd_cells dlmb_bram_if_cntlr]

current_bd_instance /arm
connect_bd_intf_net [get_bd_intf_pins FIXED_IO] [get_bd_intf_pins arm_system/FIXED_IO]
connect_bd_intf_net [get_bd_intf_pins DDR] [get_bd_intf_pins arm_system/DDR]
connect_bd_net -net mb_dataminer_Clk [get_bd_pins arm_system/FCLK_CLK0] [get_bd_pins FCLK_CLK0] [get_bd_pins FCLK_CLK1]
connect_bd_net -net processing_system7_0_FCLK_RESET0_N [get_bd_pins arm_system/FCLK_RESET0_N] [get_bd_pins FCLK_RESET0_N]

current_bd_instance /
connect_bd_intf_net [get_bd_intf_ports iic_motorboard] [get_bd_intf_pins sensor_actor/IIC]
connect_bd_intf_net [get_bd_intf_ports debug_led_sensor_actor] [get_bd_intf_pins sensor_actor/GPIO1]
connect_bd_intf_net [get_bd_intf_pins sensor_actor/DEBUG] [get_bd_intf_pins mdm_copter/MBDEBUG_0]
connect_bd_intf_net [get_bd_intf_ports debug_led_flight_controller] [get_bd_intf_pins flight_controller/GPIO]
connect_bd_intf_net [get_bd_intf_ports uart_remote_control] [get_bd_intf_pins sensor_actor/UART]
connect_bd_intf_net [get_bd_intf_pins blk_mem_gen_sa_fc/BRAM_PORTB] [get_bd_intf_pins sensor_actor/BRAM_PORTA]
connect_bd_intf_net [get_bd_intf_ports spi_battery_guard] [get_bd_intf_pins sensor_actor/SPI_0]
connect_bd_intf_net [get_bd_intf_ports iic_imu] [get_bd_intf_pins sensor_actor/IIC1]
connect_bd_intf_net [get_bd_intf_ports iic_bu] [get_bd_intf_pins sensor_actor/IIC2]
connect_bd_intf_net [get_bd_intf_ports FIXED_IO] [get_bd_intf_pins arm/FIXED_IO]
connect_bd_intf_net [get_bd_intf_ports DDR] [get_bd_intf_pins arm/DDR]
connect_bd_intf_net [get_bd_intf_pins sensor_actor/M00_AXI] [get_bd_intf_pins mdm_copter/S_AXI]
connect_bd_intf_net [get_bd_intf_pins blk_mem_gen_sa_fc/BRAM_PORTA] [get_bd_intf_pins flight_controller/BRAM_PORTA]
connect_bd_intf_net [get_bd_intf_pins flight_controller/DEBUG] [get_bd_intf_pins mdm_copter/MBDEBUG_1]
connect_bd_net -net aevv_system_FCLK_CLK1 [get_bd_pins arm/FCLK_CLK1] [get_bd_pins sensor_actor/ext_spi_clk]
connect_bd_net -net mb_dataminer_Clk [get_bd_pins arm/FCLK_CLK0] \
  [get_bd_pins flight_controller/s_axi_aclk] [get_bd_pins sensor_actor/LMB_Clk] [get_bd_pins mdm_copter/S_AXI_ACLK] \
  [get_bd_pins rst_processing_system7_0_100M/slowest_sync_clk]
connect_bd_net -net mdm_1_debug_sys_rst [get_bd_pins mdm_copter/Debug_SYS_Rst] [get_bd_pins rst_processing_system7_0_100M/mb_debug_sys_rst]
connect_bd_net [get_bd_ports ppm] [get_bd_pins sensor_actor/ppm]
connect_bd_net -net processing_system7_0_FCLK_RESET0_N [get_bd_pins arm/FCLK_RESET0_N] [get_bd_pins rst_processing_system7_0_100M/ext_reset_in]
connect_bd_net [get_bd_pins rst_processing_system7_0_100M/bus_struct_reset] [get_bd_pins flight_controller/LMB_Rst] [get_bd_pins sensor_actor/LMB_Rst]
connect_bd_net [get_bd_pins rst_processing_system7_0_100M/interconnect_aresetn] \
  [get_bd_pins flight_controller/ARESETN] [get_bd_pins sensor_actor/ARESETN]
connect_bd_net [get_bd_pins rst_processing_system7_0_100M/mb_reset] [get_bd_pins flight_controller/Reset] [get_bd_pins sensor_actor/Reset]
connect_bd_net [get_bd_pins rst_processing_system7_0_100M/peripheral_aresetn] \
  [get_bd_pins flight_controller/s_axi_aresetn] [get_bd_pins sensor_actor/s_axi_aresetn] \
  [get_bd_pins mdm_copter/S_AXI_ARESETN]

# ---- address map ----
assign_bd_address -offset 0x00000000 -range 128K -target_address_space [get_bd_addr_spaces flight_controller/flight_controller_mb/Data] [get_bd_addr_segs flight_controller/flight_controller_local_memory/dlmb_bram_if_cntlr/SLMB/Mem]
assign_bd_address -offset 0x40000000 -range 4K -target_address_space [get_bd_addr_spaces flight_controller/flight_controller_mb/Data] [get_bd_addr_segs flight_controller/axi_bram_ctrl_fc_to_sa/S_AXI/Mem0]
assign_bd_address -offset 0x40010000 -range 64K -target_address_space [get_bd_addr_spaces flight_controller/flight_controller_mb/Data] [get_bd_addr_segs flight_controller/axi_gpio_debug_led_fc/S_AXI/Reg]
assign_bd_address -offset 0x41200000 -range 64K -target_address_space [get_bd_addr_spaces flight_controller/flight_controller_mb/Data] [get_bd_addr_segs flight_controller/axi_intc_fc/S_AXI/Reg]
assign_bd_address -offset 0x41C00000 -range 64K -target_address_space [get_bd_addr_spaces flight_controller/flight_controller_mb/Data] [get_bd_addr_segs flight_controller/axi_timer_fc/S_AXI/Reg]
assign_bd_address -offset 0x00000000 -range 128K -target_address_space [get_bd_addr_spaces flight_controller/flight_controller_mb/Instruction] [get_bd_addr_segs flight_controller/flight_controller_local_memory/ilmb_bram_if_cntlr/SLMB/Mem]
assign_bd_address -offset 0x00000000 -range 128K -target_address_space [get_bd_addr_spaces sensor_actor/sensor_actor_mb/Data] [get_bd_addr_segs sensor_actor/sensor_actor_local_memory/dlmb_bram_if_cntlr/SLMB/Mem]
assign_bd_address -offset 0x40000000 -range 64K -target_address_space [get_bd_addr_spaces sensor_actor/sensor_actor_mb/Data] [get_bd_addr_segs sensor_actor/axi_gpio_debug_leds_sa/S_AXI/Reg]
assign_bd_address -offset 0x40600000 -range 64K -target_address_space [get_bd_addr_spaces sensor_actor/sensor_actor_mb/Data] [get_bd_addr_segs sensor_actor/axi_uartlite_remote_control/S_AXI/Reg]
assign_bd_address -offset 0x40800000 -range 64K -target_address_space [get_bd_addr_spaces sensor_actor/sensor_actor_mb/Data] [get_bd_addr_segs sensor_actor/axi_iic_imu/S_AXI/Reg]
assign_bd_address -offset 0x40810000 -range 64K -target_address_space [get_bd_addr_spaces sensor_actor/sensor_actor_mb/Data] [get_bd_addr_segs sensor_actor/axi_iic_bu/S_AXI/Reg]
assign_bd_address -offset 0x40820000 -range 64K -target_address_space [get_bd_addr_spaces sensor_actor/sensor_actor_mb/Data] [get_bd_addr_segs sensor_actor/axi_iic_motors/S_AXI/Reg]
assign_bd_address -offset 0x41200000 -range 64K -target_address_space [get_bd_addr_spaces sensor_actor/sensor_actor_mb/Data] [get_bd_addr_segs sensor_actor/axi_intc_sa/S_AXI/Reg]
assign_bd_address -offset 0x41400000 -range 4K -target_address_space [get_bd_addr_spaces sensor_actor/sensor_actor_mb/Data] [get_bd_addr_segs mdm_copter/S_AXI/Reg]
assign_bd_address -offset 0x41C00000 -range 64K -target_address_space [get_bd_addr_spaces sensor_actor/sensor_actor_mb/Data] [get_bd_addr_segs sensor_actor/axi_timer_sa/S_AXI/Reg]
assign_bd_address -offset 0x44A00000 -range 64K -target_address_space [get_bd_addr_spaces sensor_actor/sensor_actor_mb/Data] [get_bd_addr_segs sensor_actor/ppm_interpreter_remote_control/S00_AXI/S00_AXI_reg]
assign_bd_address -offset 0x44A10000 -range 64K -target_address_space [get_bd_addr_spaces sensor_actor/sensor_actor_mb/Data] [get_bd_addr_segs sensor_actor/axi_spi_battery_guard/AXI_LITE/Reg]
assign_bd_address -offset 0x44A20000 -range 64K -target_address_space [get_bd_addr_spaces sensor_actor/sensor_actor_mb/Data] [get_bd_addr_segs sensor_actor/xadc_sa/s_axi_lite/Reg]
assign_bd_address -offset 0xC0000000 -range 4K -target_address_space [get_bd_addr_spaces sensor_actor/sensor_actor_mb/Data] [get_bd_addr_segs sensor_actor/axi_bram_ctrl_sa/S_AXI/Mem0]
assign_bd_address -offset 0x00000000 -range 128K -target_address_space [get_bd_addr_spaces sensor_actor/sensor_actor_mb/Instruction] [get_bd_addr_segs sensor_actor/sensor_actor_local_memory/ilmb_bram_if_cntlr/SLMB/Mem]

validate_bd_design
save_bd_design
